# Altium project BalanceRobot.PrjPcb
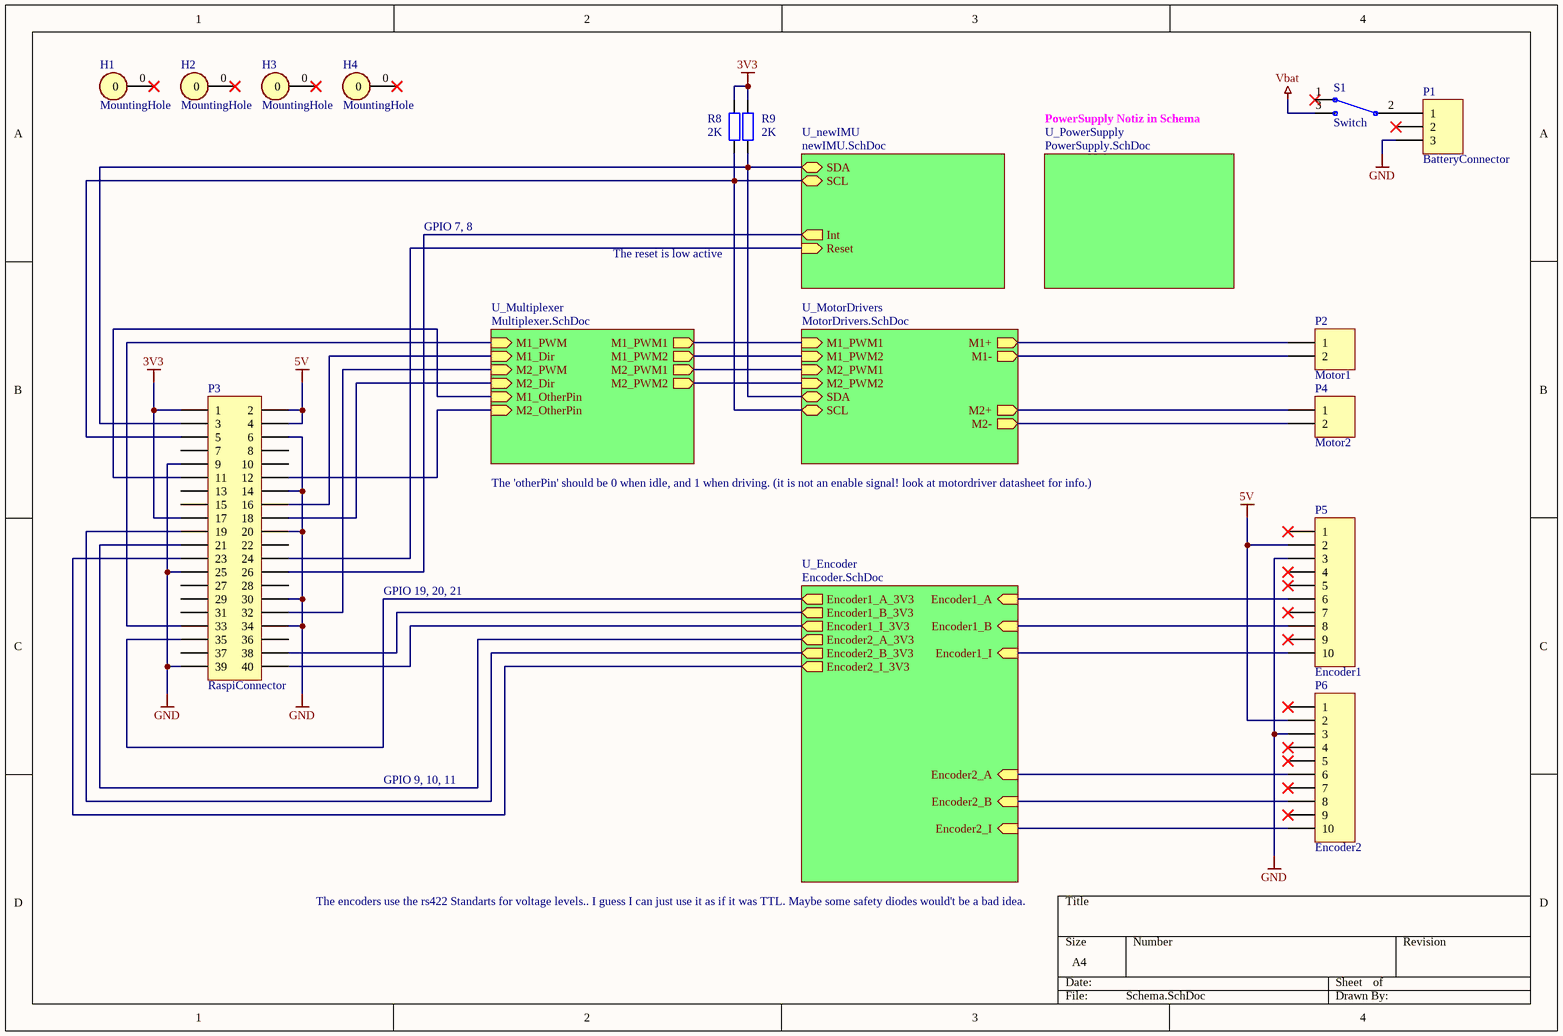
[diagram p0: Schema.SchDoc]
6 sheets, 64 parts. Net scope: hierarchical (ports join the sheet entries above them; power ports are global).
Board file: PCB_V12.PcbDoc
Sheets:
  Schema.SchDoc
    U_PowerSupply = PowerSupply.SchDoc
    U_Encoder = Encoder.SchDoc
    U_MotorDrivers = MotorDrivers.SchDoc
    U_Multiplexer = Multiplexer.SchDoc
    U_newIMU = newIMU.SchDoc

## Sheet Schema.SchDoc
size A4; SheetNumber: 2; SheetTotal: 6

### Parts
H1  MountingHole  [MountingHole]
H2  MountingHole  [MountingHole]
H3  MountingHole  [MountingHole]
H4  MountingHole  [MountingHole]
P1  BatteryConnector  [BatteryConnector]
P2  Motor1  [MotorConnector]
P3  RaspiConnector  [HDR2X20]
P4  Motor2  [MotorConnector]
P5  Encoder1  [EncoderConnector]
P6  Encoder2  [EncoderConnector]
R8  value 2K  [0805_Lorin]  (hidden comment: Res2)
R9  value 2K  [0805_Lorin]  (hidden comment: Res2)
S1  Switch  [Switch]

### Sub-sheets
U_Encoder = Encoder.SchDoc: Encoder1_A (in), Encoder1_B (in), Encoder1_I (in), Encoder2_A (in), Encoder2_B (in), Encoder2_I (in), Encoder1_A_3V3 (out), Encoder1_B_3V3 (out), Encoder1_I_3V3 (out), Encoder2_A_3V3 (out), Encoder2_B_3V3 (out), Encoder2_I_3V3 (out)
U_MotorDrivers = MotorDrivers.SchDoc: M1+ (out), M1- (out), M2+ (out), M2- (out), M1_PWM1 (in), M1_PWM2 (in), M2_PWM1 (in), M2_PWM2 (in), SDA (bidir), SCL (bidir)
U_Multiplexer = Multiplexer.SchDoc: M1_PWM (in), M1_Dir (in), M2_PWM (in), M2_Dir (in), M1_PWM1 (out), M1_PWM2 (out), M2_PWM1 (out), M2_PWM2 (out), M1_OtherPin (in), M2_OtherPin (in)
U_newIMU = newIMU.SchDoc: SDA (bidir), SCL (bidir), Int (out), Reset (in)
U_PowerSupply = PowerSupply.SchDoc: no entries

### Nets
3V3: P3.1 P3.17 R8.2 R9.2
5V: P3.2 P3.4 P5.2 P6.2
GND: P1.3 P3.6 P3.9 P3.14 P3.20 P3.25 P3.30 P3.34 P3.39 P5.3 P6.3
Vbat: S1.3
NetB1_2: sheet U_MotorDrivers/M1_PWM2, sheet U_Multiplexer/M1_PWM2
NetB1_3: sheet U_MotorDrivers/M1_PWM1, sheet U_Multiplexer/M1_PWM1
NetB1_6: P2.1 ; sheet U_MotorDrivers/M1+
NetB1_8: P2.2 ; sheet U_MotorDrivers/M1-
NetB2_4: P3.3 R9.1 ; sheet U_MotorDrivers/SDA, sheet U_newIMU/SDA
NetB2_5: P3.5 R8.1 ; sheet U_MotorDrivers/SCL, sheet U_newIMU/SCL
NetB3_2: sheet U_MotorDrivers/M2_PWM2, sheet U_Multiplexer/M2_PWM2
NetB3_3: sheet U_MotorDrivers/M2_PWM1, sheet U_Multiplexer/M2_PWM1
NetB3_6: P4.1 ; sheet U_MotorDrivers/M2+
NetB3_8: P4.2 ; sheet U_MotorDrivers/M2-
NetB8_2: P3.35 ; sheet U_Encoder/Encoder1_A_3V3
NetB8_3: P3.38 ; sheet U_Encoder/Encoder1_B_3V3
NetB8_4: P3.40 ; sheet U_Encoder/Encoder1_I_3V3
NetB8_11: P5.10 ; sheet U_Encoder/Encoder1_I
NetB8_12: P5.8 ; sheet U_Encoder/Encoder1_B
NetB8_13: P5.6 ; sheet U_Encoder/Encoder1_A
NetB9_2: P3.21 ; sheet U_Encoder/Encoder2_A_3V3
NetB9_3: P3.19 ; sheet U_Encoder/Encoder2_B_3V3
NetB9_4: P3.23 ; sheet U_Encoder/Encoder2_I_3V3
NetB9_11: P6.10 ; sheet U_Encoder/Encoder2_I
NetB9_12: P6.8 ; sheet U_Encoder/Encoder2_B
NetB9_13: P6.6 ; sheet U_Encoder/Encoder2_A
NetB10_1: P3.16 ; sheet U_Multiplexer/M1_Dir
NetB10_2: P3.33 ; sheet U_Multiplexer/M1_PWM
NetB10_3: P3.11 ; sheet U_Multiplexer/M1_OtherPin
NetB11_1: P3.18 ; sheet U_Multiplexer/M2_Dir
NetB11_2: P3.32 ; sheet U_Multiplexer/M2_PWM
NetB11_3: P3.12 ; sheet U_Multiplexer/M2_OtherPin
NetP1_1: P1.1 S1.2
NetP3_24: P3.24 ; sheet U_newIMU/Reset
NetP3_26: P3.26 ; sheet U_newIMU/Int

Not connected (* = marked no-connect by the designer): H1 0*; H2 0*; H3 0*; H4 0*; P1 2*; P3 7 8 10 13 15 22 27 28 29 31 36 37; P5 1* 4* 5* 7* 9*; P6 1* 4* 5* 7* 9*; S1 1*

### Notes on the sheet
- PowerSupply Notiz in Schema
- GPIO 7, 8
- The reset is low active
- The 'otherPin' should be 0 when idle, and 1 when driving. (it is not an enable signal! look at motordriver datasheet for info.)
- GPIO 19, 20, 21
- GPIO 9, 10, 11
- The encoders use the rs422 Standarts for voltage levels.. I guess I can just use it as if it was TTL. Maybe some safety diodes would't be a bad idea.

### Library data of the parts
P1 = Header 3: Header, 3-Pin; LatestRevisionDate: 17-Jul-2002; LatestRevisionNote: Re-released for DXP Platform.; Publisher: Altium Limited
P2 P4 = Header 2: Header, 2-Pin; LatestRevisionDate: 17-Jul-2002; LatestRevisionNote: Re-released for DXP Platform.; Publisher: Altium Limited
P3 = Header 20X2: Header, 20-Pin, Dual row; LatestRevisionDate: 17-Jul-2002; LatestRevisionNote: Re-released for DXP Platform.; Publisher: Altium Limited
P5 P6 = Header 10: Header, 10-Pin; LatestRevisionDate: 17-Jul-2002; LatestRevisionNote: Re-released for DXP Platform.; Publisher: Altium Limited
R8 R9 = Res2: Resistor; Published: 8-Jun-2000; LatestRevisionDate: 17-Jul-2002; LatestRevisionNote: Re-released for DXP Platform.; PackageReference: AXIAL-0.4; Publisher: Altium Limited; PackageDescription: Axial Device, Thru-Hole; 2 Leads; 0.4 in Pin Spacing

## Sheet PowerSupply.SchDoc
size A4; SheetNumber: 4; SheetTotal: 6; SPICEModelCacheOLNMVHDA: <root> / <DocumentId>OLNMVHDA</DocumentId> / <CacheFrame Number="0"> / <Model Name="led0" Kind="MDL"> / <Text>*Typ INFRARED GaAs LED: Vf=1.2V Vr=5V If=40mA trr=3uS / *LED Pinout: 1=A, 2=K / .MODEL LED0 D (IS=93.5P RS=84M N=2.63 BV=5 IBV=10U / + CJO=2.97P VJ=.75 M=.333 TT=4.32U)</Text> / </Model> / <Model Name="skydiode" Kind="MDL"> / <Text>*Default Schottky Diode / *Schottky Diode Pinout: A,K / .MODEL SKYDIODE D(EG=0.69 XTI=2)</Text> / </Model> / </CacheFrame> / </root>
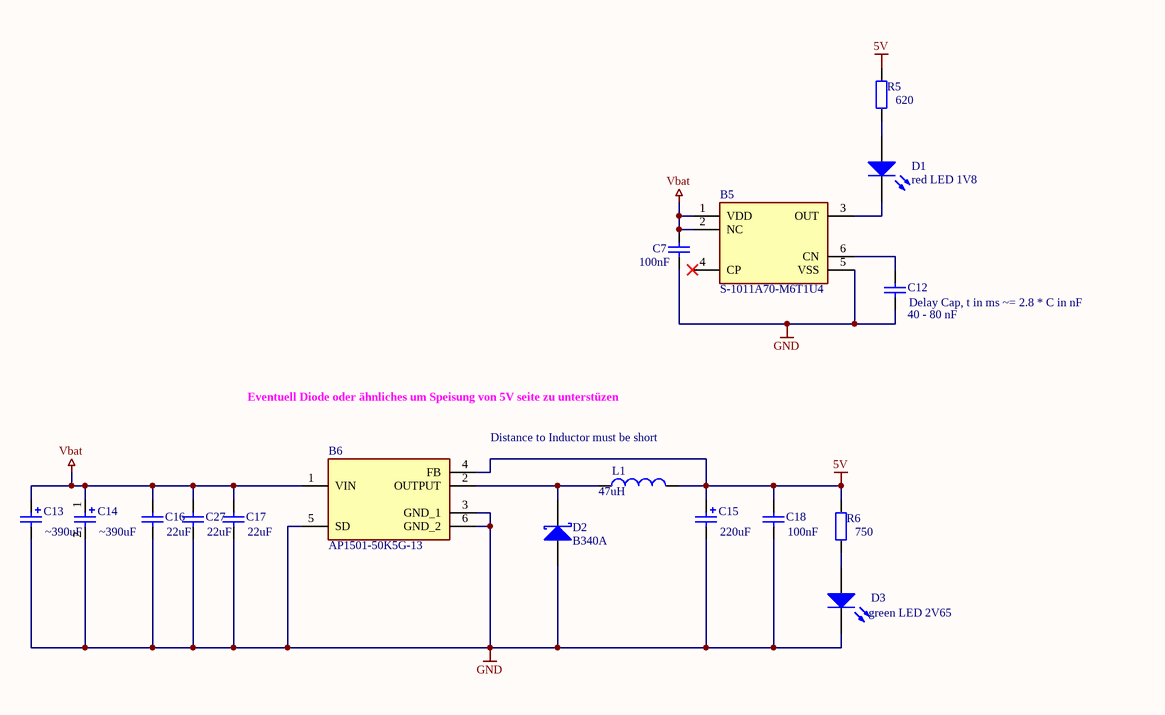
[diagram p1: PowerSupply.SchDoc]

### Parts
B5  S-1011A70-M6T1U4  [SOT95P275X135-6N]
B6  AP1501-50K5G-13  [AP150150K5G13]
C7  value 100nF  [0805_Lorin]  (hidden comment: Cap)
C12  value 40 - 80 nF  [0805_Lorin]  (hidden comment: Cap)
C13  value ~390uF  [CAP390uF]  (hidden comment: Cap Pol2)
C14  value ~390uF  [CAP390uF]  (hidden comment: Cap Pol2)
C15  value 220uF  [CAP220uF]  (hidden comment: Cap Pol2)
C16  value 22uF  [0805_Lorin]  (hidden comment: Cap)
C17  value 22uF  [0805_Lorin]  (hidden comment: Cap)
C18  value 100nF  [0805_Lorin]  (hidden comment: Cap)
C27  value 22uF  [0805_Lorin]  (hidden comment: Cap)
D1  red LED 1V8  [LEDC2012X75M]
D2  B340A  [SODFL5226X110M]
D3  green LED 2V65  [LEDC2012X75M]
L1  value 47uH  [Inductor]  (hidden comment: Inductor)
R5  value 620  [0805_Lorin]  (hidden comment: Res2)
R6  value 750  [0805_Lorin]  (hidden comment: Res2)

### Nets
5V: B6.4(FB) C15.1 C18.2 L1.2 R5.2 R6.2
GND: B5.5(VSS) B6.3(GND_1) B6.5(SD) B6.6(GND_2) C7.1 C12.1 C13.2 C14.2 C15.2 C16.1 C17.1 C18.1 C27.1 D2.1(A) D3.2(K)
Vbat: B5.1(VDD) B5.2(NC) B6.1(VIN) C7.2 C13.1 C14.1 C16.2 C17.2 C27.2
NetB5_3: B5.3(OUT) D1.2(K)
NetB5_6: B5.6(CN) C12.2
NetB6_2: B6.2(OUTPUT) D2.2(K) L1.1
NetD1_1: D1.1(A) R5.1
NetD3_1: D3.1(A) R6.1

Not connected (* = marked no-connect by the designer): B5 4(CP)*

### Notes on the sheet
- (near C12) Delay Cap, t in ms ~= 2.8 * C in nF
- Eventuell Diode oder ähnliches um Speisung von 5V seite zu unterstüzen
- Distance to Inductor must be short

### Library data of the parts
B5 = S-1011A70-M6T1U4: Supervisory Circuits VOLTAGE DETECTOR; Manufacturer_Name: ABLIC Inc.; Geometry.Height: 1.35mm; Mouser Part Number: 628-S-1011A70-M6T1U4; Mouser Price/Stock: https://www.mouser.co.uk/ProductDetail/ABLIC/S-1011A70-M6T1U4?qs=sE1HjTVAc2hYS3q6FFCWDQ%3D%3D; Manufacturer_Part_Number: S-1011A70-M6T1U4; Datasheet Link: https://www.digikey.co.uk/en/products/detail/ablic-u-s-a-inc/S-1011A70-M6T1U4/6601814
B6 = AP1501-50K5G-13: IC REG BUCK 5V 3A TO263-5; Manufacturer_Name: Diodes Inc.; Geometry.Height: 4.85mm; Mouser Part Number: 621-AP1501-50K5G-13; Mouser Price/Stock: https://www.mouser.co.uk/ProductDetail/Diodes-Incorporated/AP1501-50K5G-13?qs=oUsD4qhOtFyyLLjAHWqfUw%3D%3D; Manufacturer_Part_Number: AP1501-50K5G-13; Datasheet Link: https://www.diodes.com/assets/Datasheets/AP1501.pdf
C7 C12 C16-C18 C27 = Cap: Capacitor; Published: 8-Jun-2000; LatestRevisionDate: 17-Jul-2002; LatestRevisionNote: Re-released for DXP Platform.; PackageReference: RAD-0.3; Publisher: Altium Limited; PackageDescription: Radial Cap, Thru-Hole; 2 Leads; 0.3 in Pin Spacing
C13-C15 = Cap Pol2: Polarized Capacitor (Axial); Published: 8-Jun-2000; LatestRevisionDate: 17-Jul-2002; LatestRevisionNote: Re-released for DXP Platform.; PackageReference: POLAR0.8; Publisher: Altium Limited; PackageDescription: Polarized Capacitor; 2 Leads
D1 D3 = LED0: Typical INFRARED GaAs LED; Published: 8-Jun-2000; LatestRevisionDate: 08-Jul-2005; LatestRevisionNote: Mech Layer 1 removed.; PackageReference: LED-0; Publisher: Altium Limited; PackageDescription: LED; 2 Leads
D2 = D Schottky: Schottky Diode; Published: 8-Jun-2000; LatestRevisionDate: 17-Jul-2002; LatestRevisionNote: Re-released for DXP Platform.; PackageReference: SMB; Publisher: Altium Limited; PackageDescription: DO-214-AA/SMB; 2 C-Bend Leads; Body 5.3 x 3.6 mm, inc. leads (LxW); Code_JEDEC: DO-214-AA
L1 = Inductor: Code_IEC: 1005; Published: 8-Jun-2000; LatestRevisionDate: 29-May-2009; LatestRevisionNote: IPC-7351 Footprint Added.; PackageReference: 0402-A; Publisher: Altium Limited; PackageDescription: Chip Inductor; Code_JEITA: 0402
R5 R6 = Res2: Resistor; Published: 8-Jun-2000; LatestRevisionDate: 17-Jul-2002; LatestRevisionNote: Re-released for DXP Platform.; PackageReference: AXIAL-0.4; Publisher: Altium Limited; PackageDescription: Axial Device, Thru-Hole; 2 Leads; 0.4 in Pin Spacing

## Sheet Encoder.SchDoc
size A4; SheetNumber: 5; SheetTotal: 6
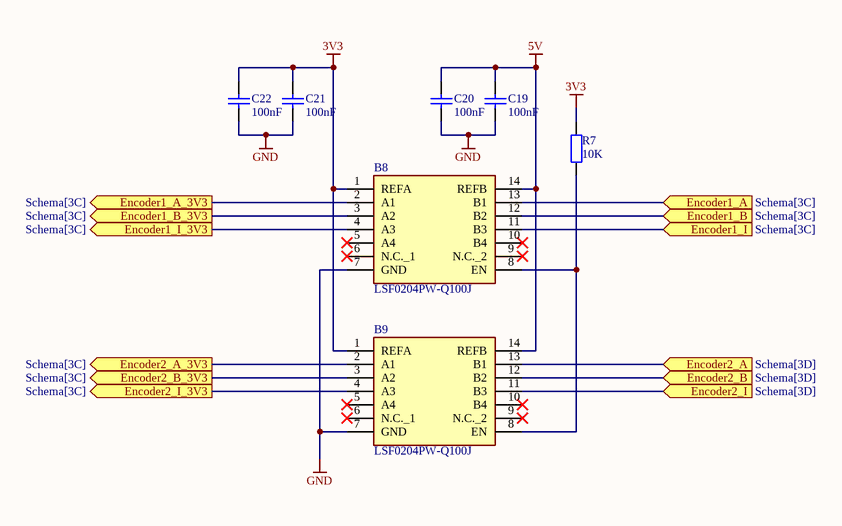
[diagram p2: Encoder.SchDoc]

### Parts
B8  LSF0204PW-Q100J  [SOP65P640X110-14M]
B9  LSF0204PW-Q100J  [SOP65P640X110-14M]
C19  value 100nF  [0805_Lorin]  (hidden comment: Cap)
C20  value 100nF  [0805_Lorin]  (hidden comment: Cap)
C21  value 100nF  [0805_Lorin]  (hidden comment: Cap)
C22  value 100nF  [0805_Lorin]  (hidden comment: Cap)
R7  value 10K  [0805_Lorin]  (hidden comment: Res2)

### Ports
Encoder1_A (in, see Schema[3C]), Encoder1_A_3V3 (out, see Schema[3C]), Encoder1_B (in, see Schema[3C]), Encoder1_B_3V3 (out, see Schema[3C]), Encoder1_I (in, see Schema[3C]), Encoder1_I_3V3 (out, see Schema[3C]), Encoder2_A (in, see Schema[3D]), Encoder2_A_3V3 (out, see Schema[3C]), Encoder2_B (in, see Schema[3D]), Encoder2_B_3V3 (out, see Schema[3C]), Encoder2_I (in, see Schema[3D]), Encoder2_I_3V3 (out, see Schema[3C])

### Nets
3V3: B8.1(REFA) B9.1(REFA) C21.2 C22.2 R7.2
5V: B8.14(REFB) B9.14(REFB) C19.2 C20.2
GND: B8.7(GND) B9.7(GND) C19.1 C20.1 C21.1 C22.1
NetB8_2: B8.2(A1) ; port Encoder1_A_3V3
NetB8_3: B8.3(A2) ; port Encoder1_B_3V3
NetB8_4: B8.4(A3) ; port Encoder1_I_3V3
NetB8_8: B8.8(EN) B9.8(EN) R7.1
NetB8_11: B8.11(B3) ; port Encoder1_I
NetB8_12: B8.12(B2) ; port Encoder1_B
NetB8_13: B8.13(B1) ; port Encoder1_A
NetB9_2: B9.2(A1) ; port Encoder2_A_3V3
NetB9_3: B9.3(A2) ; port Encoder2_B_3V3
NetB9_4: B9.4(A3) ; port Encoder2_I_3V3
NetB9_11: B9.11(B3) ; port Encoder2_I
NetB9_12: B9.12(B2) ; port Encoder2_B
NetB9_13: B9.13(B1) ; port Encoder2_A

Not connected (* = marked no-connect by the designer): B8 5(A4)* 6(N.C._1)* 9(N.C._2)* 10(B4)*; B9 5(A4)* 6(N.C._1)* 9(N.C._2)* 10(B4)*

### Library data of the parts
B8 B9 = LSF0204PW-Q100J: Translation - Voltage Levels ANALOG & LOGIC ICS; Manufacturer_Name: Nexperia; Geometry.Height: 1.1mm; Mouser Part Number: 771-LSF0204PW-Q100J; Mouser Price/Stock: https://www.mouser.co.uk/ProductDetail/Nexperia/LSF0204PW-Q100J?qs=DPoM0jnrROXA8naUdxkzeA%3D%3D; Manufacturer_Part_Number: LSF0204PW-Q100J; Datasheet Link: https://assets.nexperia.com/documents/data-sheet/LSF0204_Q100.pdf
C19-C22 = Cap: Capacitor; Published: 8-Jun-2000; LatestRevisionDate: 17-Jul-2002; LatestRevisionNote: Re-released for DXP Platform.; PackageReference: RAD-0.3; Publisher: Altium Limited; PackageDescription: Radial Cap, Thru-Hole; 2 Leads; 0.3 in Pin Spacing
R7 = Res2: Resistor; Published: 8-Jun-2000; LatestRevisionDate: 17-Jul-2002; LatestRevisionNote: Re-released for DXP Platform.; PackageReference: AXIAL-0.4; Publisher: Altium Limited; PackageDescription: Axial Device, Thru-Hole; 2 Leads; 0.4 in Pin Spacing

## Sheet MotorDrivers.SchDoc
size A4; SheetNumber: 3; SheetTotal: 6
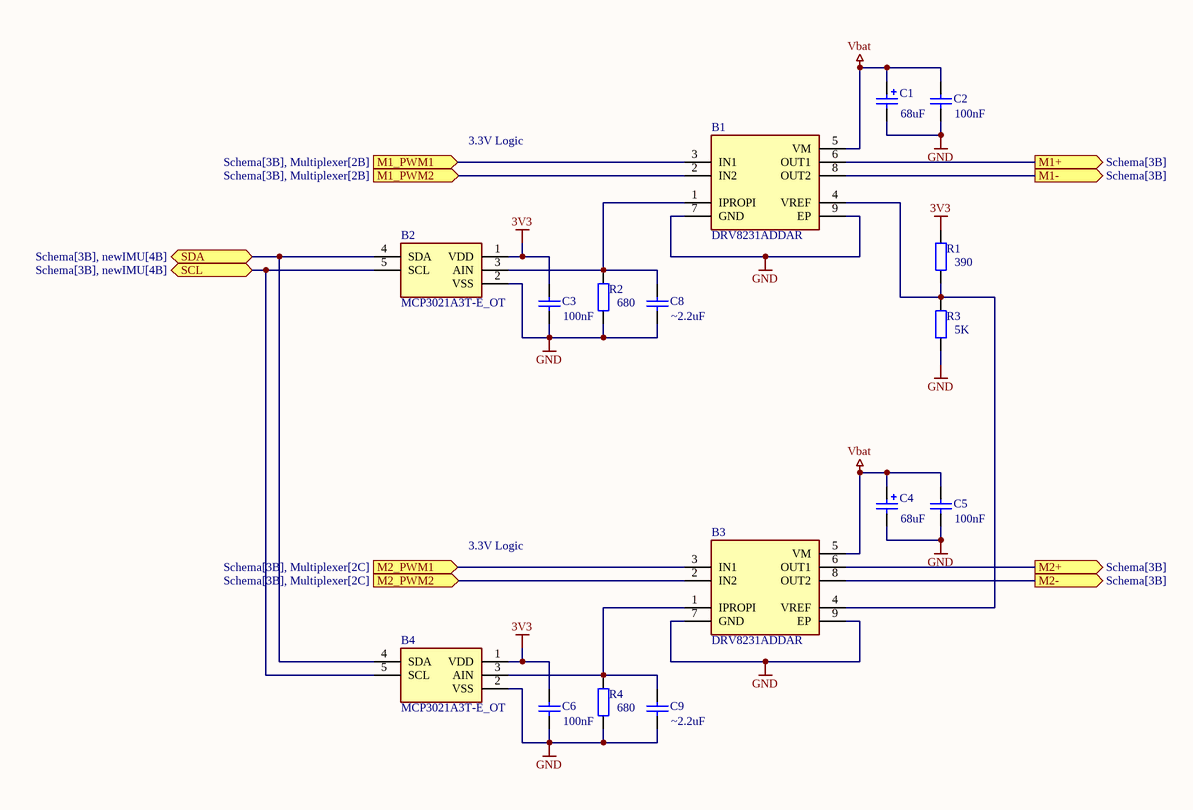
[diagram p3: MotorDrivers.SchDoc]

### Parts
B1  DRV8231ADDAR  [SOIC127P600X170-9M]
B2  MCP3021A3T-E_OT  [SOT95P280X145-5M]
B3  DRV8231ADDAR  [SOIC127P600X170-9M]
B4  MCP3021A3T-E_OT  [SOT95P280X145-5M]
C1  value 68uF  [CAP68uF]  (hidden comment: Cap Pol2)
C2  value 100nF  [0805_Lorin]  (hidden comment: Cap)
C3  value 100nF  [0805_Lorin]  (hidden comment: Cap)
C4  value 68uF  [CAP68uF]  (hidden comment: Cap Pol2)
C5  value 100nF  [0805_Lorin]  (hidden comment: Cap)
C6  value 100nF  [0805_Lorin]  (hidden comment: Cap)
C8  value ~2.2uF  [0805_Lorin]  (hidden comment: Cap)
C9  value ~2.2uF  [0805_Lorin]  (hidden comment: Cap)
R1  value 390  [0805_Lorin]  (hidden comment: Res2)
R2  value 680  [0805_Lorin]  (hidden comment: Res2)
R3  value 5K  [0805_Lorin]  (hidden comment: Res2)
R4  value 680  [0805_Lorin]  (hidden comment: Res2)

### Ports
M1+ (out, see Schema[3B]), M1- (out, see Schema[3B]), M1_PWM1 (in, see Schema[3B], Multiplexer[2B]), M1_PWM2 (in, see Schema[3B], Multiplexer[2B]), M2+ (out, see Schema[3B]), M2- (out, see Schema[3B]), M2_PWM1 (in, see Schema[3B], Multiplexer[2C]), M2_PWM2 (in, see Schema[3B], Multiplexer[2C]), SCL (bidir, see Schema[3B], newIMU[4B]), SDA (bidir, see Schema[3B], newIMU[4B])

### Nets
3V3: B2.1(VDD) B4.1(VDD) C3.2 C6.2 R1.2
GND: B1.7(GND) B1.9(EP) B2.2(VSS) B3.7(GND) B3.9(EP) B4.2(VSS) C1.2 C2.2 C3.1 C4.2 C5.2 C6.1 C8.1 C9.1 R2.1 R3.1 R4.1
Vbat: B1.5(VM) B3.5(VM) C1.1 C2.1 C4.1 C5.1
NetB1_1: B1.1(IPROPI) B2.3(AIN) C8.2 R2.2
NetB1_2: B1.2(IN2) ; port M1_PWM2
NetB1_3: B1.3(IN1) ; port M1_PWM1
NetB1_4: B1.4(VREF) B3.4(VREF) R1.1 R3.2
NetB1_6: B1.6(OUT1) ; port M1+
NetB1_8: B1.8(OUT2) ; port M1-
NetB2_4: B2.4(SDA) B4.4(SDA) ; port SDA
NetB2_5: B2.5(SCL) B4.5(SCL) ; port SCL
NetB3_1: B3.1(IPROPI) B4.3(AIN) C9.2 R4.2
NetB3_2: B3.2(IN2) ; port M2_PWM2
NetB3_3: B3.3(IN1) ; port M2_PWM1
NetB3_6: B3.6(OUT1) ; port M2+
NetB3_8: B3.8(OUT2) ; port M2-

### Notes on the sheet
- 3.3V Logic

### Library data of the parts
B1 B3 = DRV8231ADDAR: Motor Drives 33V H bridge motor driver with current regulation and current sense feedback; Manufacturer_Name: Texas Instruments; Geometry.Height: 1.7mm; Mouser Part Number: 595-DRV8231ADDAR; Mouser Price/Stock: https://www.mouser.co.uk/ProductDetail/Texas-Instruments/DRV8231ADDAR?qs=Li%252BoUPsLEnsv4Ur6m37LNQ%3D%3D; Manufacturer_Part_Number: DRV8231ADDAR; Datasheet Link: https://www.ti.com/lit/ds/symlink/drv8231a.pdf?ts=1647897918552&ref_url=https%253A%252F%252Fwww.ti.com%252Fstore%252Fti%252Fen%252Fp%252Fproduct%252F%253Fp%253DDRV8231ADDAR%2526keyMatch%253DDRV8231ADDAR%2526tisearch%253Dsearch-everything%2526usecase%253DO
B2 B4 = MCP3021A3T-E_OT: Analog to Digital Converters - ADC 10-bit ADC I2C Single Channel; Manufacturer_Name: Microchip; Manufacturer_Part_Number: MCP3021A3T-E/OT; Geometry.Height: 1.45mm; Mouser Part Number: 579-MCP3021A3T-E/OT; Mouser Price/Stock: https://www.mouser.co.uk/ProductDetail/Microchip-Technology/MCP3021A3T-E-OT?qs=uHi2%2FQoPa5Cra0xx31l%252Buw%3D%3D; Datasheet Link: http://www.microchip.com/mymicrochip/filehandler.aspx?ddocname=en011709
C1 C4 = Cap Pol2: Polarized Capacitor (Axial); Published: 8-Jun-2000; LatestRevisionDate: 17-Jul-2002; LatestRevisionNote: Re-released for DXP Platform.; PackageReference: POLAR0.8; Publisher: Altium Limited; PackageDescription: Polarized Capacitor; 2 Leads
C2 C3 C5 C6 C8 C9 = Cap: Capacitor; Published: 8-Jun-2000; LatestRevisionDate: 17-Jul-2002; LatestRevisionNote: Re-released for DXP Platform.; PackageReference: RAD-0.3; Publisher: Altium Limited; PackageDescription: Radial Cap, Thru-Hole; 2 Leads; 0.3 in Pin Spacing
R1-R4 = Res2: Resistor; Published: 8-Jun-2000; LatestRevisionDate: 17-Jul-2002; LatestRevisionNote: Re-released for DXP Platform.; PackageReference: AXIAL-0.4; Publisher: Altium Limited; PackageDescription: Axial Device, Thru-Hole; 2 Leads; 0.4 in Pin Spacing

## Sheet Multiplexer.SchDoc
size A4; SheetNumber: 6; SheetTotal: 6
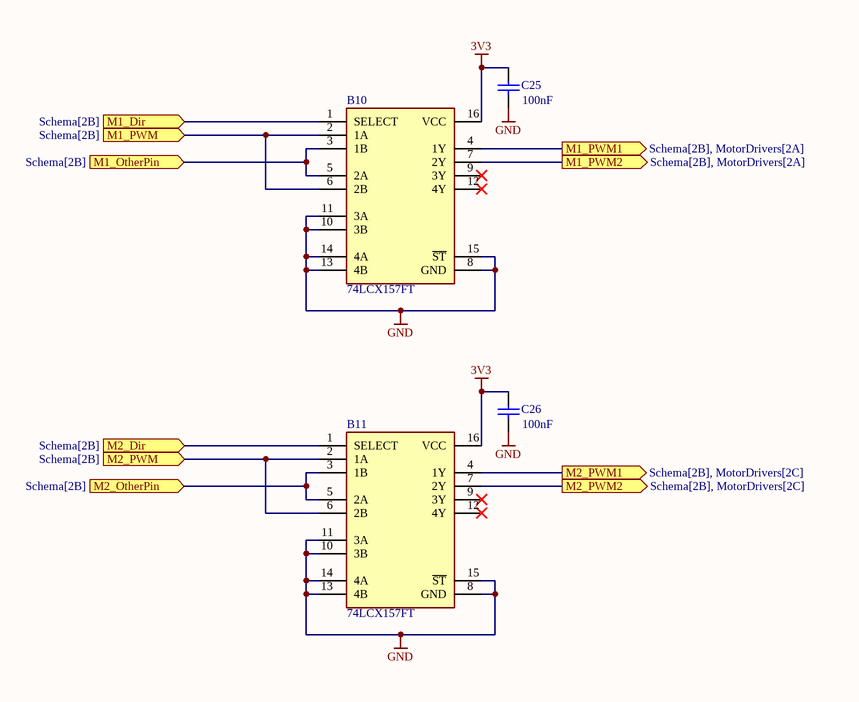
[diagram p4: Multiplexer.SchDoc]

### Parts
B10  74LCX157FT  [SOP65P640X120-16M]
B11  74LCX157FT  [SOP65P640X120-16M]
C25  value 100nF  [0805_Lorin]  (hidden comment: Cap)
C26  value 100nF  [0805_Lorin]  (hidden comment: Cap)

### Ports
M1_Dir (in, see Schema[2B]), M1_OtherPin (in, see Schema[2B]), M1_PWM1 (out, see Schema[2B], MotorDrivers[2A]), M1_PWM2 (out, see Schema[2B], MotorDrivers[2A]), M1_PWM (in, see Schema[2B]), M2_Dir (in, see Schema[2B]), M2_OtherPin (in, see Schema[2B]), M2_PWM1 (out, see Schema[2B], MotorDrivers[2C]), M2_PWM2 (out, see Schema[2B], MotorDrivers[2C]), M2_PWM (in, see Schema[2B])

### Nets
3V3: B10.16(VCC) B11.16(VCC) C25.1 C26.1
GND: B10.8(GND) B10.10(3B) B10.11(3A) B10.13(4B) B10.14(4A) B10.15(~{ST}) B11.8(GND) B11.10(3B) B11.11(3A) B11.13(4B) B11.14(4A) B11.15(~{ST}) C25.2 C26.2
NetB1_2: B10.7(2Y) ; port M1_PWM2
NetB1_3: B10.4(1Y) ; port M1_PWM1
NetB3_2: B11.7(2Y) ; port M2_PWM2
NetB3_3: B11.4(1Y) ; port M2_PWM1
NetB10_1: B10.1(SELECT) ; port M1_Dir
NetB10_2: B10.2(1A) B10.6(2B) ; port M1_PWM
NetB10_3: B10.3(1B) B10.5(2A) ; port M1_OtherPin
NetB11_1: B11.1(SELECT) ; port M2_Dir
NetB11_2: B11.2(1A) B11.6(2B) ; port M2_PWM
NetB11_3: B11.3(1B) B11.5(2A) ; port M2_OtherPin

Not connected (* = marked no-connect by the designer): B10 9(3Y)* 12(4Y)*; B11 9(3Y)* 12(4Y)*

### Library data of the parts
B10 B11 = 74LCX157FT: 74LCX157FT Toshiba, Multiplexer Quad, -0.5  6.5 V, 16-Pin TSSOP; Geometry.Height: 1.2mm; Mouser Part Number: 757-74LCX157FT; Mouser Price/Stock: https://www.mouser.co.uk/ProductDetail/Toshiba/74LCX157FT?qs=F5EMLAvA7IBvOqmQf3om6A%3D%3D; Manufacturer_Name: Toshiba; Manufacturer_Part_Number: 74LCX157FT; Datasheet Link: https://toshiba.semicon-storage.com/eu/semiconductor/product/general-purpose-logic-ics/detail.74LCX157FT.html
C25 C26 = Cap: Capacitor; Published: 8-Jun-2000; LatestRevisionDate: 17-Jul-2002; LatestRevisionNote: Re-released for DXP Platform.; PackageReference: RAD-0.3; Publisher: Altium Limited; PackageDescription: Radial Cap, Thru-Hole; 2 Leads; 0.3 in Pin Spacing

## Sheet newIMU.SchDoc
size A4; SheetNumber: 6; SheetTotal: 6
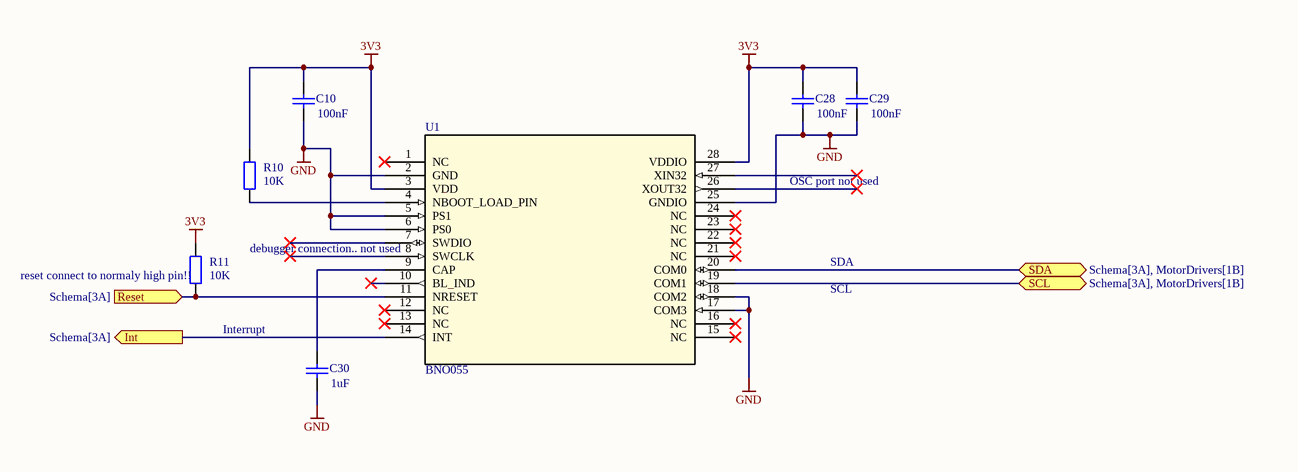
[diagram p5: newIMU.SchDoc]

### Parts
C10  value 100nF  [0805_Lorin]  (hidden comment: Cap)
C28  value 100nF  [0805_Lorin]  (hidden comment: Cap)
C29  value 100nF  [0805_Lorin]  (hidden comment: Cap)
C30  value 1uF  [0805_Lorin]  (hidden comment: Cap)
R10  value 10K  [0805_Lorin]  (hidden comment: Res2)
R11  value 10K  [0805_Lorin]  (hidden comment: Res2)
U1  BNO055  [QFN_BNO055_BOS]

### Ports
Int (out, see Schema[3A]), Reset (in, see Schema[3A]), SCL (bidir, see Schema[3A], MotorDrivers[1B]), SDA (bidir, see Schema[3A], MotorDrivers[1B])

### Nets
3V3: C10.2 C28.2 C29.2 R10.2 R11.2 U1.3(VDD) U1.28(VDDIO)
GND: C10.1 C28.1 C29.1 C30.1 U1.2(GND) U1.5(PS1) U1.6(PS0) U1.17(COM3) U1.18(COM2) U1.25(GNDIO)
NetB2_4: U1.20(COM0) ; port SDA
NetB2_5: U1.19(COM1) ; port SCL
NetC30_2: C30.2 U1.9(CAP)
NetP3_24: R11.1 U1.11(NRESET) ; port Reset
NetP3_26: U1.14(INT) ; port Int
NetR10_1: R10.1 U1.4(NBOOT_LOAD_PIN)

Not connected (* = marked no-connect by the designer): U1 1(NC)* 7(SWDIO)* 8(SWCLK)* 10(BL_IND)* 12(NC)* 13(NC)* 15(NC)* 16(NC)* 21(NC)* 22(NC)* 23(NC)* 24(NC)* 26(XOUT32)* 27(XIN32)*

### Notes on the sheet
- OSC port not used
- (near U1) debugger connection.. not used
- (near R11) reset connect to normaly high pin!!
- SCL
- SDA
- Interrupt

### Library data of the parts
C10 C28-C30 = Cap: Capacitor; Published: 8-Jun-2000; LatestRevisionDate: 17-Jul-2002; LatestRevisionNote: Re-released for DXP Platform.; PackageReference: RAD-0.3; Publisher: Altium Limited; PackageDescription: Radial Cap, Thru-Hole; 2 Leads; 0.3 in Pin Spacing
R10 R11 = Res2: Resistor; Published: 8-Jun-2000; LatestRevisionDate: 17-Jul-2002; LatestRevisionNote: Re-released for DXP Platform.; PackageReference: AXIAL-0.4; Publisher: Altium Limited; PackageDescription: Axial Device, Thru-Hole; 2 Leads; 0.4 in Pin Spacing
U1 = BNO055: No Description Available; Mfr_Name: Bosch Sensortec; Copyright: Copyright (C) 2024 Ultra Librarian. All rights reserved.; Manufacturer_Part_Number: BNO055; RefDes: RefDes; Type: DEV

## Nets that join several sheets
3V3: Schema (P3.1 P3.17 R8.2 R9.2), Encoder (5 pins), MotorDrivers (5 pins), Multiplexer (B10.16 B11.16 C25.1 C26.1), newIMU (7 pins)
5V: Schema (P3.2 P3.4 P5.2 P6.2), PowerSupply (6 pins), Encoder (B8.14 B9.14 C19.2 C20.2)
GND: Schema (11 pins), PowerSupply (15 pins), Encoder (6 pins), MotorDrivers (17 pins), Multiplexer (14 pins), newIMU (10 pins)
Vbat: Schema (S1.3), PowerSupply (9 pins), MotorDrivers (6 pins)
NetB1_2: MotorDrivers (B1.2), Multiplexer (B10.7)
NetB1_3: MotorDrivers (B1.3), Multiplexer (B10.4)
NetB1_6: Schema (P2.1), MotorDrivers (B1.6)
NetB1_8: Schema (P2.2), MotorDrivers (B1.8)
NetB2_4: Schema (P3.3 R9.1), MotorDrivers (B2.4 B4.4), newIMU (U1.20)
NetB2_5: Schema (P3.5 R8.1), MotorDrivers (B2.5 B4.5), newIMU (U1.19)
NetB3_2: MotorDrivers (B3.2), Multiplexer (B11.7)
NetB3_3: MotorDrivers (B3.3), Multiplexer (B11.4)
NetB3_6: Schema (P4.1), MotorDrivers (B3.6)
NetB3_8: Schema (P4.2), MotorDrivers (B3.8)
NetB8_2: Schema (P3.35), Encoder (B8.2)
NetB8_3: Schema (P3.38), Encoder (B8.3)
NetB8_4: Schema (P3.40), Encoder (B8.4)
NetB8_11: Schema (P5.10), Encoder (B8.11)
NetB8_12: Schema (P5.8), Encoder (B8.12)
NetB8_13: Schema (P5.6), Encoder (B8.13)
NetB9_2: Schema (P3.21), Encoder (B9.2)
NetB9_3: Schema (P3.19), Encoder (B9.3)
NetB9_4: Schema (P3.23), Encoder (B9.4)
NetB9_11: Schema (P6.10), Encoder (B9.11)
NetB9_12: Schema (P6.8), Encoder (B9.12)
NetB9_13: Schema (P6.6), Encoder (B9.13)
NetB10_1: Schema (P3.16), Multiplexer (B10.1)
NetB10_2: Schema (P3.33), Multiplexer (B10.2 B10.6)
NetB10_3: Schema (P3.11), Multiplexer (B10.3 B10.5)
NetB11_1: Schema (P3.18), Multiplexer (B11.1)
NetB11_2: Schema (P3.32), Multiplexer (B11.2 B11.6)
NetB11_3: Schema (P3.12), Multiplexer (B11.3 B11.5)
NetP3_24: Schema (P3.24), newIMU (R11.1 U1.11)
NetP3_26: Schema (P3.26), newIMU (U1.14)